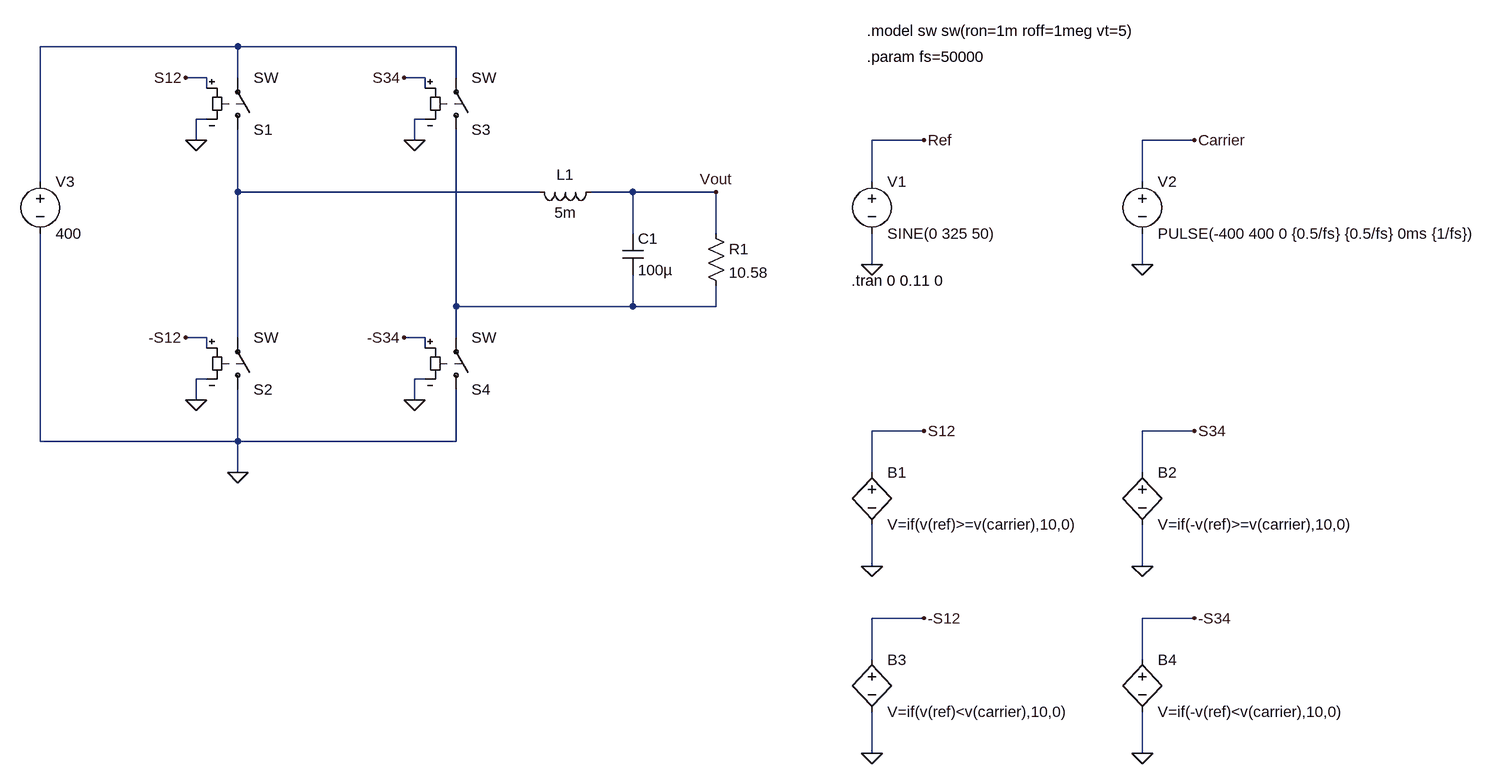
[diagram p0: schematic FullBridge_UnipolarModulation.asc]
FullBridge_UnipolarModulation.asc, the LTspice schematic file:
Version 4
SHEET 1 1336 804
WIRE -656 -304 -960 -304
WIRE -320 -304 -656 -304
WIRE -704 -256 -736 -256
WIRE -656 -256 -656 -304
WIRE -368 -256 -400 -256
WIRE -320 -256 -320 -304
WIRE -704 -240 -704 -256
WIRE -368 -240 -368 -256
WIRE -704 -192 -720 -192
WIRE -368 -192 -384 -192
WIRE -720 -160 -720 -192
WIRE -384 -160 -384 -192
WIRE 400 -160 320 -160
WIRE 816 -160 736 -160
WIRE -960 -96 -960 -304
WIRE 320 -96 320 -160
WIRE 736 -96 736 -160
WIRE -656 -80 -656 -176
WIRE -192 -80 -656 -80
WIRE -48 -80 -112 -80
WIRE 80 -80 -48 -80
WIRE -48 -16 -48 -80
WIRE 80 -16 80 -80
WIRE 320 32 320 -16
WIRE 736 32 736 -16
WIRE -320 96 -320 -176
WIRE -48 96 -48 48
WIRE -48 96 -320 96
WIRE 80 96 80 64
WIRE 80 96 -48 96
WIRE -704 144 -736 144
WIRE -656 144 -656 -80
WIRE -368 144 -400 144
WIRE -320 144 -320 96
WIRE -704 160 -704 144
WIRE -368 160 -368 144
WIRE -704 208 -720 208
WIRE -368 208 -384 208
WIRE -720 240 -720 208
WIRE -384 240 -384 208
WIRE 400 288 320 288
WIRE 816 288 736 288
WIRE -960 304 -960 -16
WIRE -656 304 -656 224
WIRE -656 304 -960 304
WIRE -320 304 -320 224
WIRE -320 304 -656 304
WIRE -656 352 -656 304
WIRE 320 352 320 288
WIRE 736 352 736 288
WIRE 320 496 320 432
WIRE 736 496 736 432
WIRE 400 576 320 576
WIRE 816 576 736 576
WIRE 320 640 320 576
WIRE 736 640 736 576
WIRE 320 784 320 720
WIRE 736 784 736 720
FLAG 320 32 0
FLAG 400 -160 Ref
FLAG 736 32 0
FLAG 816 -160 Carrier
FLAG 736 496 0
FLAG 320 496 0
FLAG 400 288 S12
FLAG 816 288 S34
FLAG -720 -160 0
FLAG -384 240 0
FLAG -720 240 0
FLAG -384 -160 0
FLAG -736 -256 S12
FLAG -400 144 -S34
FLAG -736 144 -S12
FLAG -400 -256 S34
FLAG -656 352 0
FLAG 80 -80 Vout
FLAG 736 784 0
FLAG 320 784 0
FLAG 400 576 -S12
FLAG 816 576 -S34
SYMBOL voltage 320 -112 R0
WINDOW 123 0 0 Left 0
WINDOW 39 0 0 Left 0
SYMATTR InstName V1
SYMATTR Value SINE(0 325 50)
SYMBOL voltage 736 -112 R0
WINDOW 123 0 0 Left 0
WINDOW 39 0 0 Left 0
SYMATTR InstName V2
SYMATTR Value PULSE(-400 400 0 {0.5/fs} {0.5/fs} 0ms {1/fs})
SYMBOL bv 320 336 R0
SYMATTR InstName B1
SYMATTR Value V=if(v(ref)>=v(carrier),10,0)
SYMBOL bv 736 336 R0
SYMATTR InstName B2
SYMATTR Value V=if(-v(ref)>=v(carrier),10,0)
SYMBOL sw -656 -160 M180
SYMATTR InstName S1
SYMBOL sw -656 240 M180
SYMATTR InstName S2
SYMBOL sw -320 -160 M180
SYMATTR InstName S3
SYMBOL sw -320 240 M180
SYMATTR InstName S4
SYMBOL ind -96 -96 R90
WINDOW 0 5 56 VBottom 2
WINDOW 3 32 56 VTop 2
SYMATTR InstName L1
SYMATTR Value 5m
SYMATTR SpiceLine Rser=100m
SYMBOL res 64 -32 R0
SYMATTR InstName R1
SYMATTR Value 10.58
SYMBOL voltage -960 -112 R0
WINDOW 123 0 0 Left 0
WINDOW 39 0 0 Left 0
SYMATTR InstName V3
SYMATTR Value 400
SYMBOL cap -64 -16 R0
SYMATTR InstName C1
SYMATTR Value 100µ
SYMATTR SpiceLine Rser=100m
SYMBOL bv 320 624 R0
SYMATTR InstName B3
SYMATTR Value V=if(v(ref)<v(carrier),10,0)
SYMBOL bv 736 624 R0
SYMATTR InstName B4
SYMATTR Value V=if(-v(ref)<v(carrier),10,0)
TEXT 288 56 Left 2 !.tran 0 0.11 0
TEXT 312 -288 Left 2 !.param fs=50000
TEXT 312 -328 Left 2 !.model sw sw(ron=1m roff=1meg vt=5)

The netlist it stands for:
* FullBridge_UnipolarModulation.asc
V1 Ref 0 SINE(0 325 50)
V2 Carrier 0 PULSE(-400 400 0 {0.5/fs} {0.5/fs} 0ms {1/fs})
B1 S12 0 V=if(v(ref)>=v(carrier),10,0)
B2 S34 0 V=if(-v(ref)>=v(carrier),10,0)
S1 N002 N001 S12 0 SW
S2 0 N002 -S12 0 SW
S3 N003 N001 S34 0 SW
S4 0 N003 -S34 0 SW
L1 Vout N002 5m Rser=100m
R1 Vout N003 10.58
V3 N001 0 400
C1 Vout N003 100µ Rser=100m
B3 -S12 0 V=if(v(ref)<v(carrier),10,0)
B4 -S34 0 V=if(-v(ref)<v(carrier),10,0)
.tran 0 0.11 0
.param fs=50000
.model sw sw(ron=1m roff=1meg vt=5)
.backanno
.end